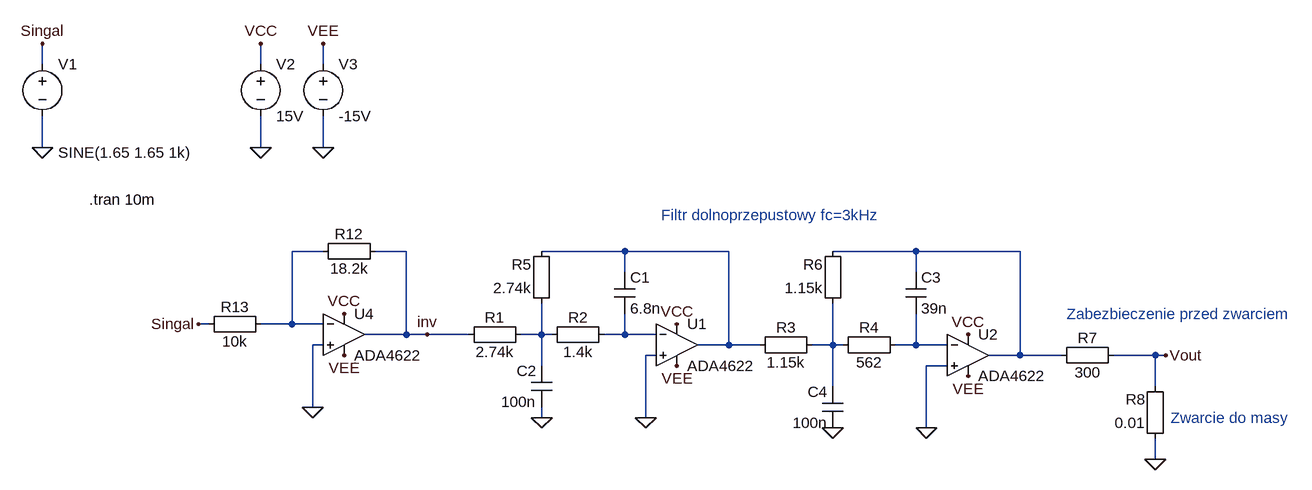
[diagram p0: schematic inv_with_filter.asc]
inv_with_filter.asc, the LTspice schematic file:
Version 4.1
SHEET 1 1288 680
WIRE -656 -336 -656 -368
WIRE -320 -336 -320 -368
WIRE -224 -336 -224 -368
WIRE -656 -208 -656 -256
WIRE -320 -208 -320 -256
WIRE -224 -208 -224 -256
WIRE -224 -48 -272 -48
WIRE -96 -48 -144 -48
WIRE 240 -48 112 -48
WIRE 400 -48 240 -48
WIRE 688 -48 560 -48
WIRE 848 -48 688 -48
WIRE 240 -16 240 -48
WIRE 688 -16 688 -48
WIRE -400 64 -416 64
WIRE -272 64 -272 -48
WIRE -272 64 -320 64
WIRE -224 64 -272 64
WIRE -96 80 -96 -48
WIRE -96 80 -160 80
WIRE -64 80 -96 80
WIRE 0 80 -64 80
WIRE 112 80 112 32
WIRE 112 80 80 80
WIRE 128 80 112 80
WIRE 240 80 240 48
WIRE 240 80 208 80
WIRE 288 80 240 80
WIRE -224 96 -240 96
WIRE 400 96 400 -48
WIRE 400 96 352 96
WIRE 448 96 400 96
WIRE 560 96 560 32
WIRE 560 96 528 96
WIRE 576 96 560 96
WIRE 688 96 688 48
WIRE 688 96 656 96
WIRE 736 96 688 96
WIRE 288 112 272 112
WIRE 848 112 848 -48
WIRE 848 112 800 112
WIRE 912 112 848 112
WIRE 1056 112 992 112
WIRE 1072 112 1056 112
WIRE 112 128 112 80
WIRE 736 128 704 128
WIRE 560 160 560 96
WIRE 1056 160 1056 112
WIRE -240 192 -240 96
WIRE 112 208 112 192
WIRE 272 208 272 112
WIRE 704 224 704 128
WIRE 1056 272 1056 240
FLAG -320 -208 0
FLAG -224 -208 0
FLAG -320 -368 VCC
FLAG -224 -368 VEE
FLAG 320 64 VCC
FLAG 320 128 VEE
FLAG 768 80 VCC
FLAG 768 144 VEE
FLAG 112 208 0
FLAG 560 224 0
FLAG 272 208 0
FLAG 704 224 0
FLAG 1072 112 Vout
FLAG -192 48 VCC
FLAG -192 112 VEE
FLAG -240 192 0
FLAG -64 80 inv
FLAG -656 -208 0
FLAG -656 -368 Singal
FLAG -416 64 Singal
FLAG 1056 272 0
SYMBOL voltage -656 -352 R0
WINDOW 3 24 152 Left 2
WINDOW 123 24 124 Left 2
WINDOW 39 0 0 Left 0
SYMATTR Value SINE(1.65 1.65 1k)
SYMATTR InstName V1
SYMBOL OpAmps\\ADA4622 320 32 R0
SYMATTR InstName U1
SYMBOL Misc\\EuropeanResistor 96 64 R90
WINDOW 0 5 56 VBottom 2
WINDOW 3 27 56 VTop 2
SYMATTR InstName R1
SYMATTR Value 2.74k
SYMBOL Misc\\EuropeanResistor 224 64 R90
WINDOW 0 5 56 VBottom 2
WINDOW 3 27 56 VTop 2
SYMATTR InstName R2
SYMATTR Value 1.4k
SYMBOL voltage -320 -352 R0
WINDOW 123 0 0 Left 0
WINDOW 39 0 0 Left 0
SYMATTR InstName V2
SYMATTR Value 15V
SYMBOL voltage -224 -352 R0
WINDOW 123 0 0 Left 0
WINDOW 39 0 0 Left 0
SYMATTR InstName V3
SYMATTR Value -15V
SYMBOL cap 128 128 M0
SYMATTR InstName C2
SYMATTR Value 100n
SYMBOL OpAmps\\ADA4622 768 48 R0
SYMATTR InstName U2
SYMBOL Misc\\EuropeanResistor 544 80 R90
WINDOW 0 5 56 VBottom 2
WINDOW 3 27 56 VTop 2
SYMATTR InstName R3
SYMATTR Value 1.15k
SYMBOL Misc\\EuropeanResistor 672 80 R90
WINDOW 0 5 56 VBottom 2
WINDOW 3 27 56 VTop 2
SYMATTR InstName R4
SYMATTR Value 562
SYMBOL cap 576 160 M0
SYMATTR InstName C4
SYMATTR Value 100n
SYMBOL Misc\\EuropeanResistor 128 48 R180
WINDOW 0 31 76 Left 2
WINDOW 3 31 40 Left 2
SYMATTR InstName R5
SYMATTR Value 2.74k
SYMBOL cap 224 -16 R0
SYMATTR InstName C1
SYMATTR Value 6.8n
SYMBOL Misc\\EuropeanResistor 576 48 R180
WINDOW 0 31 76 Left 2
WINDOW 3 31 40 Left 2
SYMATTR InstName R6
SYMATTR Value 1.15k
SYMBOL cap 672 -16 R0
SYMATTR InstName C3
SYMATTR Value 39n
SYMBOL OpAmps\\ADA4622 -192 16 R0
SYMATTR InstName U4
SYMBOL Misc\\EuropeanResistor -128 -64 R90
WINDOW 0 5 56 VBottom 2
WINDOW 3 27 56 VTop 2
SYMATTR InstName R12
SYMATTR Value 18.2k
SYMBOL Misc\\EuropeanResistor -416 80 R270
WINDOW 0 27 56 VTop 2
WINDOW 3 5 56 VBottom 2
SYMATTR InstName R13
SYMATTR Value 10k
SYMBOL Misc\\EuropeanResistor 1008 96 R90
WINDOW 0 5 56 VBottom 2
WINDOW 3 27 56 VTop 2
SYMATTR InstName R7
SYMATTR Value 300
SYMBOL Misc\\EuropeanResistor 1072 256 R180
WINDOW 0 31 76 Left 2
WINDOW 3 31 40 Left 2
SYMATTR InstName R8
SYMATTR Value 0.01
TEXT -584 -128 Left 2 !.tran 10m
TEXT 296 -104 Left 2 ;Filtr dolnoprzepustowy fc=3kHz
TEXT 920 48 Left 2 ;Zabezbieczenie przed zwarciem
TEXT 1080 208 Left 2 ;Zwarcie do masy

The netlist it stands for:
* inv_with_filter.asc
V1 Singal 0 SINE(1.65 1.65 1k)
X§U1 0 N005 VCC VEE N002 ADA4622  ; pins In+ In- V+ V- OUT
R1 N004 inv 2.74k
R2 N005 N004 1.4k
V2 VCC 0 15V
V3 VEE 0 -15V
C2 N004 0 100n
X§U2 0 N007 VCC VEE N003 ADA4622  ; pins In+ In- V+ V- OUT
R3 N006 N002 1.15k
R4 N007 N006 562
C4 N006 0 100n
R5 N004 N002 2.74k
C1 N002 N005 6.8n
R6 N006 N003 1.15k
C3 N003 N007 39n
X§U4 0 N001 VCC VEE inv ADA4622  ; pins In+ In- V+ V- OUT
R12 inv N001 18.2k
R13 Singal N001 10k
R7 Vout N003 300
R8 0 Vout 0.01
.tran 10m
* Filtr dolnoprzepustowy fc=3kHz
* Zabezbieczenie przed zwarciem
* Zwarcie do masy
.lib ADA4622.lib
.backanno
.end